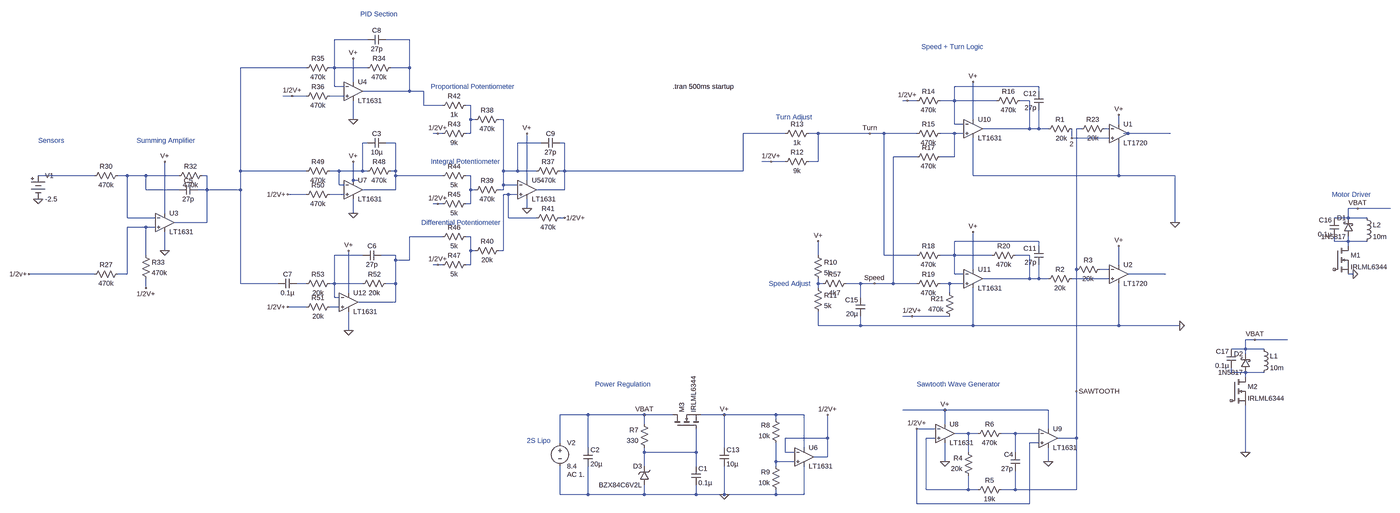
[diagram p0: schematic LTspiceIV_Simulation_AnalogLineFollower edited.asc, whole sheet]
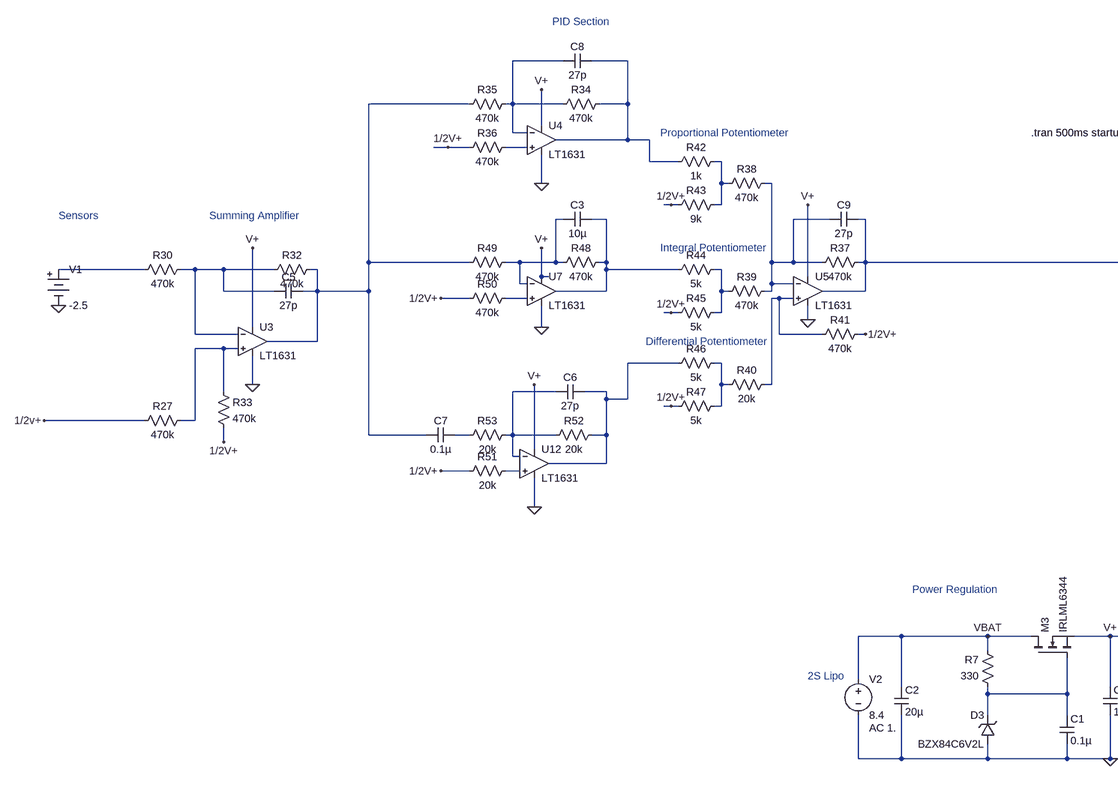
[diagram p1: schematic LTspiceIV_Simulation_AnalogLineFollower edited.asc, part, row 1 of 1, column 1 of 2]
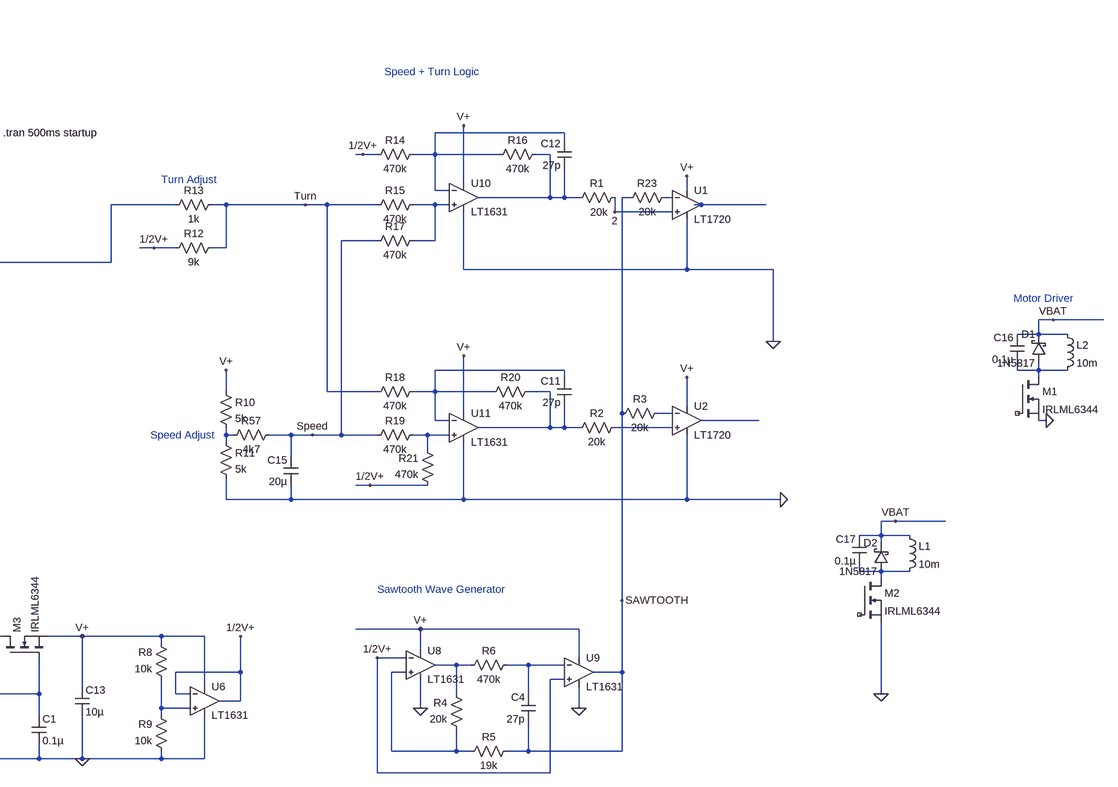
[diagram p2: schematic LTspiceIV_Simulation_AnalogLineFollower edited.asc, part, row 1 of 1, column 2 of 2]
LTspiceIV_Simulation_AnalogLineFollower edited.asc, the LTspice schematic file:
Version 4
SHEET 1 5945676 13421556
WIRE -1120 -1456 -1232 -1456
WIRE -976 -1456 -1056 -1456
WIRE -1328 -1360 -1552 -1360
WIRE -1232 -1360 -1232 -1456
WIRE -1232 -1360 -1248 -1360
WIRE -1120 -1360 -1232 -1360
WIRE -976 -1360 -976 -1456
WIRE -976 -1360 -1040 -1360
WIRE -1168 -1312 -1168 -1392
WIRE -1232 -1296 -1232 -1360
WIRE -1200 -1296 -1232 -1296
WIRE 1168 -1296 880 -1296
WIRE -976 -1280 -976 -1360
WIRE -976 -1280 -1136 -1280
WIRE -928 -1280 -976 -1280
WIRE 1168 -1280 1168 -1296
WIRE -1376 -1264 -1408 -1264
WIRE -1328 -1264 -1376 -1264
WIRE -1200 -1264 -1248 -1264
WIRE 720 -1248 704 -1248
WIRE 752 -1248 720 -1248
WIRE 880 -1248 880 -1296
WIRE 880 -1248 832 -1248
WIRE 1024 -1248 880 -1248
WIRE 1136 -1248 1104 -1248
WIRE -928 -1232 -928 -1280
WIRE -864 -1232 -928 -1232
WIRE -768 -1232 -784 -1232
WIRE -1168 -1184 -1168 -1248
WIRE -768 -1184 -768 -1232
WIRE -752 -1184 -768 -1184
WIRE -656 -1184 -672 -1184
WIRE 944 -1184 944 -1312
WIRE 880 -1168 880 -1248
WIRE 912 -1168 880 -1168
WIRE 1440 -1168 1440 -1200
WIRE 1136 -1152 1136 -1248
WIRE 1136 -1152 976 -1152
WIRE 1168 -1152 1168 -1216
WIRE 1168 -1152 1136 -1152
WIRE 1200 -1152 1168 -1152
WIRE 1312 -1152 1296 -1152
WIRE 1408 -1152 1392 -1152
WIRE -880 -1136 -896 -1136
WIRE -864 -1136 -880 -1136
WIRE -768 -1136 -768 -1184
WIRE -768 -1136 -784 -1136
WIRE 304 -1136 160 -1136
WIRE 416 -1136 384 -1136
WIRE 592 -1136 416 -1136
WIRE 640 -1136 592 -1136
WIRE 752 -1136 640 -1136
WIRE 880 -1136 832 -1136
WIRE 912 -1136 880 -1136
WIRE 1472 -1136 1456 -1136
WIRE 1616 -1136 1472 -1136
WIRE 1280 -1120 1280 -1152
WIRE 1408 -1120 1280 -1120
WIRE -1120 -1104 -1136 -1104
WIRE -1024 -1104 -1056 -1104
WIRE -528 -1104 -608 -1104
WIRE -448 -1104 -464 -1104
WIRE 752 -1056 672 -1056
WIRE 880 -1056 880 -1136
WIRE 880 -1056 832 -1056
WIRE 256 -1040 224 -1040
WIRE 304 -1040 256 -1040
WIRE 416 -1040 416 -1136
WIRE 416 -1040 384 -1040
WIRE -1552 -1008 -1552 -1360
WIRE -1328 -1008 -1552 -1008
WIRE -1216 -1008 -1248 -1008
WIRE -1136 -1008 -1136 -1104
WIRE -1136 -1008 -1216 -1008
WIRE -1120 -1008 -1136 -1008
WIRE -1024 -1008 -1024 -1104
WIRE -1024 -1008 -1040 -1008
WIRE -656 -1008 -656 -1184
WIRE -608 -1008 -608 -1104
WIRE -608 -1008 -656 -1008
WIRE -544 -1008 -608 -1008
WIRE -448 -1008 -448 -1104
WIRE -448 -1008 -464 -1008
WIRE 160 -1008 160 -1136
WIRE 160 -1008 -448 -1008
WIRE -2512 -992 -2800 -992
WIRE -2400 -992 -2432 -992
WIRE -2336 -992 -2400 -992
WIRE -2224 -992 -2336 -992
WIRE -2128 -992 -2144 -992
WIRE -1024 -992 -1024 -1008
WIRE -864 -992 -1024 -992
WIRE -768 -992 -784 -992
WIRE 944 -992 944 -1120
WIRE 1440 -992 1440 -1104
WIRE 1440 -992 944 -992
WIRE 1632 -992 1440 -992
WIRE -1168 -976 -1168 -1040
WIRE -1152 -976 -1168 -976
WIRE -576 -976 -576 -1136
WIRE -1216 -960 -1216 -1008
WIRE -1200 -960 -1216 -960
WIRE -656 -960 -656 -1008
WIRE -608 -960 -656 -960
WIRE -2336 -944 -2336 -992
WIRE -2224 -944 -2336 -944
WIRE -2128 -944 -2128 -992
WIRE -2128 -944 -2160 -944
WIRE -1552 -944 -1552 -1008
WIRE -1552 -944 -2128 -944
WIRE -1024 -944 -1024 -992
WIRE -1024 -944 -1136 -944
WIRE -768 -944 -768 -992
WIRE -752 -944 -768 -944
WIRE -656 -944 -656 -960
WIRE -656 -944 -672 -944
WIRE -448 -944 -448 -1008
WIRE -448 -944 -544 -944
WIRE -1328 -928 -1392 -928
WIRE -1200 -928 -1248 -928
WIRE -640 -928 -656 -928
WIRE -608 -928 -640 -928
WIRE -880 -896 -896 -896
WIRE -864 -896 -880 -896
WIRE -768 -896 -768 -944
WIRE -768 -896 -784 -896
WIRE -576 -880 -576 -912
WIRE 4816 -880 4784 -880
WIRE 4928 -880 4816 -880
WIRE -2272 -864 -2272 -1040
WIRE -1168 -864 -1168 -912
WIRE -2400 -848 -2400 -992
WIRE -2304 -848 -2400 -848
WIRE -640 -848 -640 -928
WIRE -544 -848 -640 -848
WIRE -448 -848 -464 -848
WIRE 4784 -848 4784 -880
WIRE 4784 -848 4736 -848
WIRE 4848 -848 4784 -848
WIRE -2128 -832 -2128 -944
WIRE -2128 -832 -2240 -832
WIRE 1632 -832 1632 -992
WIRE -2336 -816 -2400 -816
WIRE -2304 -816 -2336 -816
WIRE -864 -784 -976 -784
WIRE -768 -784 -784 -784
WIRE 1168 -768 880 -768
WIRE 4736 -768 4736 -784
WIRE 4784 -768 4784 -784
WIRE 4784 -768 4736 -768
WIRE 4848 -768 4784 -768
WIRE 1168 -752 1168 -768
WIRE 4784 -752 4784 -768
WIRE -2272 -736 -2272 -800
WIRE -768 -736 -768 -784
WIRE -752 -736 -768 -736
WIRE -656 -736 -656 -928
WIRE -656 -736 -672 -736
WIRE -2336 -720 -2336 -816
WIRE -1136 -720 -1232 -720
WIRE -1024 -720 -1072 -720
WIRE 416 -720 416 -768
WIRE 640 -720 640 -1136
WIRE 752 -720 640 -720
WIRE 880 -720 880 -768
WIRE 880 -720 832 -720
WIRE 1008 -720 880 -720
WIRE 1136 -720 1088 -720
WIRE -1024 -704 -1024 -720
WIRE -976 -704 -976 -784
WIRE -976 -704 -1024 -704
WIRE -880 -688 -896 -688
WIRE -864 -688 -880 -688
WIRE -768 -688 -768 -736
WIRE -768 -688 -784 -688
WIRE 1440 -688 1440 -752
WIRE 944 -672 944 -800
WIRE 1296 -672 1296 -1152
WIRE 1408 -672 1376 -672
WIRE -2512 -656 -2832 -656
WIRE -2400 -656 -2400 -816
WIRE -2400 -656 -2432 -656
WIRE 880 -656 880 -720
WIRE 912 -656 880 -656
WIRE 1600 -656 1472 -656
WIRE 4800 -656 4784 -656
WIRE 1136 -640 1136 -720
WIRE 1136 -640 976 -640
WIRE 1168 -640 1168 -688
WIRE 1168 -640 1136 -640
WIRE 1200 -640 1168 -640
WIRE 1408 -640 1280 -640
WIRE -1552 -624 -1552 -944
WIRE -1424 -624 -1552 -624
WIRE -1328 -624 -1360 -624
WIRE -1232 -624 -1232 -720
WIRE -1232 -624 -1248 -624
WIRE -1136 -624 -1232 -624
WIRE -1024 -624 -1024 -704
WIRE -1024 -624 -1056 -624
WIRE 416 -624 416 -640
WIRE 432 -624 416 -624
WIRE 560 -624 512 -624
WIRE 608 -624 560 -624
WIRE 672 -624 672 -1056
WIRE 672 -624 608 -624
WIRE 752 -624 672 -624
WIRE 864 -624 832 -624
WIRE 912 -624 864 -624
WIRE -2336 -608 -2336 -640
WIRE 416 -608 416 -624
WIRE -1184 -592 -1184 -736
WIRE 864 -592 864 -624
WIRE -1232 -576 -1232 -624
WIRE -1216 -576 -1232 -576
WIRE 560 -576 560 -624
WIRE -1024 -560 -1024 -624
WIRE -1024 -560 -1152 -560
WIRE -1328 -544 -1392 -544
WIRE -1216 -544 -1248 -544
WIRE 736 -512 704 -512
WIRE 864 -512 736 -512
WIRE 416 -480 416 -528
WIRE 560 -480 560 -512
WIRE 560 -480 416 -480
WIRE 944 -480 944 -608
WIRE 944 -480 560 -480
WIRE 1440 -480 1440 -624
WIRE 1440 -480 944 -480
WIRE 1648 -480 1440 -480
WIRE -1184 -464 -1184 -528
WIRE 4192 -432 4160 -432
WIRE 4304 -432 4192 -432
WIRE 4160 -400 4160 -432
WIRE 4160 -400 4112 -400
WIRE 4224 -400 4160 -400
WIRE 4160 -384 4160 -400
WIRE 4112 -320 4112 -336
WIRE 4160 -320 4112 -320
WIRE 4224 -320 4160 -320
WIRE 4160 -304 4160 -320
WIRE 1296 -256 1296 -672
WIRE 848 -192 704 -192
WIRE 1200 -192 848 -192
WIRE -368 -176 -464 -176
WIRE -176 -176 -368 -176
WIRE -80 -176 -176 -176
WIRE 96 -176 16 -176
WIRE 272 -176 96 -176
WIRE 368 -176 272 -176
WIRE 272 -160 272 -176
WIRE -176 -144 -176 -176
WIRE 848 -144 848 -192
WIRE 816 -128 752 -128
WIRE 1200 -128 1200 -192
WIRE 928 -112 880 -112
WIRE 960 -112 928 -112
WIRE 1088 -112 1040 -112
WIRE 1168 -112 1088 -112
WIRE 448 -96 448 -176
WIRE 448 -96 304 -96
WIRE 816 -96 784 -96
WIRE 1296 -96 1296 -256
WIRE 1296 -96 1232 -96
WIRE -464 -80 -464 -176
WIRE 1168 -80 1136 -80
WIRE -368 -64 -368 -176
WIRE 96 -64 96 -176
WIRE 368 -64 368 -176
WIRE -176 -48 -176 -64
WIRE 0 -48 0 -128
WIRE 0 -48 -176 -48
WIRE 304 -48 304 -96
WIRE 336 -48 304 -48
WIRE 928 -48 928 -112
WIRE 1088 -48 1088 -112
WIRE 4160 -48 4160 -208
WIRE 448 -32 448 -96
WIRE 448 -32 400 -32
WIRE 272 -16 272 -80
WIRE 336 -16 272 -16
WIRE 848 -16 848 -80
WIRE 1200 -16 1200 -64
WIRE -176 0 -176 -48
WIRE 0 0 0 -48
WIRE 272 0 272 -16
WIRE 784 80 784 -96
WIRE 928 80 928 32
WIRE 928 80 784 80
WIRE 960 80 928 80
WIRE 1088 80 1088 16
WIRE 1088 80 1040 80
WIRE 1296 80 1296 -96
WIRE 1296 80 1088 80
WIRE -464 96 -464 0
WIRE -368 96 -368 0
WIRE -368 96 -464 96
WIRE -176 96 -176 64
WIRE -176 96 -368 96
WIRE 0 96 0 64
WIRE 0 96 -176 96
WIRE 96 96 96 0
WIRE 96 96 0 96
WIRE 272 96 272 80
WIRE 272 96 96 96
WIRE 368 96 368 0
WIRE 368 96 272 96
WIRE 752 128 752 -128
WIRE 1136 128 1136 -80
WIRE 1136 128 752 128
FLAG 1296 -256 SAWTOOTH
FLAG -1184 -464 0
FLAG -1168 -1184 0
FLAG -1168 -864 0
FLAG -576 -880 0
FLAG 96 -176 V+
FLAG -1184 -736 V+
FLAG -1168 -1040 V+
FLAG -1168 -1392 V+
FLAG -576 -1136 V+
FLAG 944 -1312 V+
FLAG 1440 -1200 V+
FLAG 944 -800 V+
FLAG 1440 -752 V+
FLAG 1200 -16 0
FLAG 848 -16 0
FLAG 96 96 0
FLAG -176 -176 VBAT
FLAG 4192 -432 VBAT
FLAG 4816 -880 VBAT
FLAG -2272 -736 0
FLAG -2272 -1040 V+
FLAG 416 -768 V+
FLAG 448 -176 1/2V+
FLAG 736 -512 1/2V+
FLAG 720 -1248 1/2V+
FLAG -448 -848 1/2V+
FLAG -880 -1136 1/2V+
FLAG -880 -896 1/2V+
FLAG -880 -688 1/2V+
FLAG -1392 -544 1/2V+
FLAG -1392 -928 1/2V+
FLAG -1376 -1264 1/2V+
FLAG -2336 -608 1/2V+
FLAG 608 -624 Speed
FLAG 848 -192 V+
FLAG 1632 -832 0
FLAG 4160 -48 0
FLAG 256 -1040 1/2V+
FLAG 592 -1136 Turn
FLAG 752 -128 1/2V+
FLAG -2832 -656 1/2v+
FLAG -2800 -912 0
FLAG 4800 -656 0
FLAG 1648 -480 0
FLAG 1280 -1120 2
SYMBOL Opamps\\LT1631 368 -96 R0
SYMATTR InstName U6
SYMBOL Opamps\\LT1631 848 -176 R0
SYMATTR InstName U8
SYMBOL Opamps\\LT1631 1200 -160 R0
SYMATTR InstName U9
SYMBOL Opamps\\LT1631 944 -1216 R0
SYMATTR InstName U10
SYMBOL Opamps\\LT1631 944 -704 R0
SYMATTR InstName U11
SYMBOL res 288 -64 R180
WINDOW 0 36 76 Left 2
WINDOW 3 36 40 Left 2
SYMATTR InstName R8
SYMATTR Value 10k
SYMBOL res 288 96 R180
WINDOW 0 36 76 Left 2
WINDOW 3 36 40 Left 2
SYMATTR InstName R9
SYMATTR Value 10k
SYMBOL res 400 -736 R0
SYMATTR InstName R10
SYMATTR Value 5k
SYMBOL res 400 -624 R0
SYMATTR InstName R11
SYMATTR Value 5k
SYMBOL res 400 -1056 R90
WINDOW 0 0 56 VBottom 2
WINDOW 3 32 56 VTop 2
SYMATTR InstName R12
SYMATTR Value 9k
SYMATTR SpiceLine tol=1 pwr=0.1
SYMBOL res 400 -1152 R90
WINDOW 0 0 56 VBottom 2
WINDOW 3 32 56 VTop 2
SYMATTR InstName R13
SYMATTR Value 1k
SYMBOL res 848 -1264 R90
WINDOW 0 0 56 VBottom 2
WINDOW 3 32 56 VTop 2
SYMATTR InstName R14
SYMATTR Value 470k
SYMBOL res 848 -1152 R90
WINDOW 0 0 56 VBottom 2
WINDOW 3 32 56 VTop 2
SYMATTR InstName R15
SYMATTR Value 470k
SYMBOL res 1120 -1264 R90
WINDOW 0 0 56 VBottom 2
WINDOW 3 32 56 VTop 2
SYMATTR InstName R16
SYMATTR Value 470k
SYMBOL res 736 -1040 R270
WINDOW 0 32 56 VTop 2
WINDOW 3 0 56 VBottom 2
SYMATTR InstName R17
SYMATTR Value 470k
SYMBOL res 848 -736 R90
WINDOW 0 0 56 VBottom 2
WINDOW 3 32 56 VTop 2
SYMATTR InstName R18
SYMATTR Value 470k
SYMBOL res 848 -640 R90
WINDOW 0 0 56 VBottom 2
WINDOW 3 32 56 VTop 2
SYMATTR InstName R19
SYMATTR Value 470k
SYMBOL res 1104 -736 R90
WINDOW 0 0 56 VBottom 2
WINDOW 3 32 56 VTop 2
SYMATTR InstName R20
SYMATTR Value 470k
SYMBOL res 880 -496 R180
WINDOW 0 36 76 Left 2
WINDOW 3 36 40 Left 2
SYMATTR InstName R21
SYMATTR Value 470k
SYMBOL res 1296 -1168 R90
WINDOW 0 0 56 VBottom 2
WINDOW 3 33 51 VTop 2
SYMATTR InstName R1
SYMATTR Value 20k
SYMBOL res 1296 -656 R90
WINDOW 0 0 56 VBottom 2
WINDOW 3 32 56 VTop 2
SYMATTR InstName R2
SYMATTR Value 20k
SYMBOL res 944 48 R180
WINDOW 0 36 76 Left 2
WINDOW 3 36 40 Left 2
SYMATTR InstName R4
SYMATTR Value 20k
SYMBOL res 1056 64 R90
WINDOW 0 0 56 VBottom 2
WINDOW 3 32 56 VTop 2
SYMATTR InstName R5
SYMATTR Value 19k
SYMBOL cap 1104 16 R180
WINDOW 0 24 56 Left 2
WINDOW 3 24 8 Left 2
SYMATTR InstName C4
SYMATTR Value 27p
SYMBOL res 1056 -128 R90
WINDOW 0 0 56 VBottom 2
WINDOW 3 32 56 VTop 2
SYMATTR InstName R6
SYMATTR Value 470k
SYMBOL res 1392 -688 R90
WINDOW 0 0 56 VBottom 2
WINDOW 3 32 56 VTop 2
SYMATTR InstName R3
SYMATTR Value 20k
SYMBOL res 1408 -1168 R90
WINDOW 0 0 56 VBottom 2
WINDOW 3 32 56 VTop 2
SYMATTR InstName R23
SYMATTR Value 20k
SYMBOL cap 1184 -688 R180
WINDOW 0 24 56 Left 2
WINDOW 3 24 8 Left 2
SYMATTR InstName C11
SYMATTR Value 27p
SYMBOL cap 1184 -1216 R180
WINDOW 0 24 56 Left 2
WINDOW 3 24 8 Left 2
SYMATTR InstName C12
SYMATTR Value 27p
SYMBOL nmos 4736 -752 R0
SYMATTR InstName M1
SYMATTR Value IRLML6344
SYMBOL nmos 4112 -304 R0
SYMATTR InstName M2
SYMATTR Value IRLML6344
SYMBOL ind 4208 -416 R0
SYMATTR InstName L1
SYMATTR Value 10m
SYMATTR SpiceLine Rser=3.75
SYMBOL ind 4832 -864 R0
SYMATTR InstName L2
SYMATTR Value 10m
SYMATTR SpiceLine Rser=3.75
SYMBOL schottky 4176 -320 R180
WINDOW 0 24 64 Left 2
WINDOW 3 24 0 Left 2
SYMATTR InstName D2
SYMATTR Value 1N5817
SYMATTR Description Diode
SYMATTR Type diode
SYMBOL res -2528 -640 R270
WINDOW 0 32 56 VTop 2
WINDOW 3 0 56 VBottom 2
SYMATTR InstName R27
SYMATTR Value 470k
SYMBOL res -2528 -976 R270
WINDOW 0 32 56 VTop 2
WINDOW 3 0 56 VBottom 2
SYMATTR InstName R30
SYMATTR Value 470k
SYMBOL Opamps\\LT1631 -2272 -896 R0
SYMATTR InstName U3
SYMBOL res -2240 -976 R270
WINDOW 0 32 56 VTop 2
WINDOW 3 0 56 VBottom 2
SYMATTR InstName R32
SYMATTR Value 470k
SYMBOL res -2352 -736 R0
SYMATTR InstName R33
SYMATTR Value 470k
SYMBOL cap -2160 -960 R90
WINDOW 0 0 32 VBottom 2
WINDOW 3 32 32 VTop 2
SYMATTR InstName C5
SYMATTR Value 27p
SYMBOL Comparators\\LT1720 1440 -1200 R0
SYMATTR InstName U1
SYMBOL Comparators\\LT1720 1440 -720 R0
SYMATTR InstName U2
SYMBOL Opamps\\LT1631 -1168 -1344 R0
SYMATTR InstName U4
SYMBOL res -1136 -1344 R270
WINDOW 0 32 56 VTop 2
WINDOW 3 0 56 VBottom 2
SYMATTR InstName R34
SYMATTR Value 470k
SYMBOL res -1344 -1344 R270
WINDOW 0 32 56 VTop 2
WINDOW 3 0 56 VBottom 2
SYMATTR InstName R35
SYMATTR Value 470k
SYMBOL res -1344 -1248 R270
WINDOW 0 32 56 VTop 2
WINDOW 3 0 56 VBottom 2
SYMATTR InstName R36
SYMATTR Value 470k
SYMBOL Opamps\\LT1631 -576 -1008 R0
SYMATTR InstName U5
SYMBOL res -560 -992 R270
WINDOW 0 32 56 VTop 2
WINDOW 3 0 56 VBottom 2
SYMATTR InstName R37
SYMATTR Value 470k
SYMBOL res -768 -1168 R270
WINDOW 0 32 56 VTop 2
WINDOW 3 0 56 VBottom 2
SYMATTR InstName R38
SYMATTR Value 470k
SYMBOL res -768 -928 R270
WINDOW 0 32 56 VTop 2
WINDOW 3 0 56 VBottom 2
SYMATTR InstName R39
SYMATTR Value 470k
SYMBOL res -768 -720 R270
WINDOW 0 32 56 VTop 2
WINDOW 3 0 56 VBottom 2
SYMATTR InstName R40
SYMATTR Value 20k
SYMBOL res -560 -832 R270
WINDOW 0 32 56 VTop 2
WINDOW 3 0 56 VBottom 2
SYMATTR InstName R41
SYMATTR Value 470k
SYMBOL res -880 -1216 R270
WINDOW 0 32 56 VTop 2
WINDOW 3 0 56 VBottom 2
SYMATTR InstName R42
SYMATTR Value 1k
SYMBOL res -880 -1120 R270
WINDOW 0 32 56 VTop 2
WINDOW 3 0 56 VBottom 2
SYMATTR InstName R43
SYMATTR Value 9k
SYMBOL res -880 -976 R270
WINDOW 0 32 56 VTop 2
WINDOW 3 0 56 VBottom 2
SYMATTR InstName R44
SYMATTR Value 5k
SYMBOL res -880 -880 R270
WINDOW 0 32 56 VTop 2
WINDOW 3 0 56 VBottom 2
SYMATTR InstName R45
SYMATTR Value 5k
SYMBOL res -880 -768 R270
WINDOW 0 32 56 VTop 2
WINDOW 3 0 56 VBottom 2
SYMATTR InstName R46
SYMATTR Value 5k
SYMBOL res -880 -672 R270
WINDOW 0 32 56 VTop 2
WINDOW 3 0 56 VBottom 2
SYMATTR InstName R47
SYMATTR Value 5k
SYMBOL Opamps\\LT1631 -1168 -1008 R0
SYMATTR InstName U7
SYMBOL res -1136 -992 R270
WINDOW 0 32 56 VTop 2
WINDOW 3 0 56 VBottom 2
SYMATTR InstName R48
SYMATTR Value 470k
SYMBOL res -1344 -992 R270
WINDOW 0 32 56 VTop 2
WINDOW 3 0 56 VBottom 2
SYMATTR InstName R49
SYMATTR Value 470k
SYMBOL res -1344 -912 R270
WINDOW 0 32 56 VTop 2
WINDOW 3 0 56 VBottom 2
SYMATTR InstName R50
SYMATTR Value 470k
SYMBOL cap -1120 -1088 R270
WINDOW 0 32 32 VTop 2
WINDOW 3 0 32 VBottom 2
SYMATTR InstName C3
SYMATTR Value 10µ
SYMBOL Opamps\\LT1631 -1184 -624 R0
SYMATTR InstName U12
SYMBOL res -1344 -528 R270
WINDOW 0 32 56 VTop 2
WINDOW 3 0 56 VBottom 2
SYMATTR InstName R51
SYMATTR Value 20k
SYMBOL res -1152 -608 R270
WINDOW 0 32 56 VTop 2
WINDOW 3 0 56 VBottom 2
SYMATTR InstName R52
SYMATTR Value 20k
SYMBOL res -1344 -608 R270
WINDOW 0 32 56 VTop 2
WINDOW 3 0 56 VBottom 2
SYMATTR InstName R53
SYMATTR Value 20k
SYMBOL cap -1136 -704 R270
WINDOW 0 32 32 VTop 2
WINDOW 3 0 32 VBottom 2
SYMATTR InstName C6
SYMATTR Value 27p
SYMBOL cap -1424 -608 R270
WINDOW 0 32 32 VTop 2
WINDOW 3 0 32 VBottom 2
SYMATTR InstName C7
SYMATTR Value 0.1µ
SYMBOL cap -1056 -1472 R90
WINDOW 0 0 32 VBottom 2
WINDOW 3 32 32 VTop 2
SYMATTR InstName C8
SYMATTR Value 27p
SYMBOL cap -464 -1120 R90
WINDOW 0 0 32 VBottom 2
WINDOW 3 32 32 VTop 2
SYMATTR InstName C9
SYMATTR Value 27p
SYMBOL nmos -80 -128 R270
SYMATTR InstName M3
SYMATTR Value IRLML6344
SYMBOL res -160 -48 R180
WINDOW 0 36 76 Left 2
WINDOW 3 36 40 Left 2
SYMATTR InstName R7
SYMATTR Value 330
SYMBOL zener -160 64 R180
WINDOW 0 24 64 Left 2
WINDOW 3 24 0 Left 2
SYMATTR InstName D3
SYMATTR Value BZX84C6V2L
SYMATTR Description Diode
SYMATTR Type diode
SYMBOL cap -16 0 R0
SYMATTR InstName C1
SYMATTR Value 0.1µ
SYMBOL voltage -464 -96 R0
WINDOW 123 24 124 Left 2
WINDOW 39 0 0 Left 2
SYMATTR Value2 AC 1.
SYMATTR InstName V2
SYMATTR Value 8.4
SYMBOL cap -384 -64 R0
SYMATTR InstName C2
SYMATTR Value 20µ
SYMBOL cap 80 -64 R0
SYMATTR InstName C13
SYMATTR Value 10µ
SYMBOL res 528 -640 R90
WINDOW 0 0 56 VBottom 2
WINDOW 3 32 56 VTop 2
SYMATTR InstName R57
SYMATTR Value 4k7
SYMBOL cap 576 -512 R180
WINDOW 0 24 56 Left 2
WINDOW 3 24 8 Left 2
SYMATTR InstName C15
SYMATTR Value 20µ
SYMBOL schottky 4800 -784 R180
WINDOW 0 24 64 Left 2
WINDOW 3 24 0 Left 2
SYMATTR InstName D1
SYMATTR Value 1N5817
SYMATTR Description Diode
SYMATTR Type diode
SYMBOL cap 4752 -784 R180
WINDOW 0 24 56 Left 2
WINDOW 3 24 8 Left 2
SYMATTR InstName C16
SYMATTR Value 0.1µ
SYMBOL cap 4128 -336 R180
WINDOW 0 24 56 Left 2
WINDOW 3 24 8 Left 2
SYMATTR InstName C17
SYMATTR Value 0.1µ
SYMBOL Misc\\battery -2800 -1008 R0
WINDOW 123 0 0 Left 0
WINDOW 39 0 0 Left 0
SYMATTR InstName V1
SYMATTR Value -2.5
TEXT -80 -1296 Left 2 !.tran 500ms startup
TEXT -1144 -1544 Left 2 ;PID Section
TEXT -2800 -1112 Left 2 ;Sensors
TEXT -2368 -1112 Left 2 ;Summing Amplifier
TEXT -904 -1296 Left 2 ;Proportional Potentiometer
TEXT -904 -1040 Left 2 ;Integral Potentiometer
TEXT -936 -832 Left 2 ;Differential Potentiometer
TEXT -344 -280 Left 2 ;Power Regulation
TEXT 752 -280 Left 2 ;Sawtooth Wave Generator
TEXT 768 -1432 Left 2 ;Speed + Turn Logic
TEXT 4728 -928 Left 2 ;Motor Driver
TEXT 248 -624 Left 2 ;Speed Adjust
TEXT 272 -1192 Left 2 ;Turn Adjust
TEXT -576 -88 Left 2 ;2S Lipo

The netlist it stands for:
* LTspiceIV_Simulation_AnalogLineFollower edited.asc
XU6 N039 1/2V+ V+ 0 1/2V+ LT1630  ; LT1631, pins In+ In- V+ V- OUT
XU8 N037 1/2V+ V+ 0 N035 LT1630  ; LT1631, pins In+ In- V+ V- OUT
XU9 1/2V+ N036 V+ 0 SAWTOOTH LT1630  ; LT1631, pins In+ In- V+ V- OUT
XU10 N011 N004 V+ 0 N006 LT1630  ; LT1631, pins In+ In- V+ V- OUT
XU11 N032 N023 V+ 0 N026 LT1630  ; LT1631, pins In+ In- V+ V- OUT
R8 N039 V+ 10k
R9 0 N039 10k
R10 V+ N031 5k
R11 N031 0 5k
R12 Turn 1/2V+ 9k tol=1 pwr=0.1
R13 Turn N010 1k
R14 N004 1/2V+ 470k
R15 N011 Turn 470k
R16 N006 N004 470k
R17 Speed N011 470k
R18 N023 Turn 470k
R19 N032 Speed 470k
R20 N026 N023 470k
R21 1/2V+ N032 470k
R1 2 N006 20k
R2 N029 N026 20k
R4 N037 N035 20k
R5 SAWTOOTH N037 19k
C4 SAWTOOTH N036 27p
R6 N036 N035 470k
R3 N027 SAWTOOTH 20k
R23 N009 SAWTOOTH 20k
C11 N026 N023 27p
C12 N006 N004 27p
M1 N024 NC_01 0 0 IRLML6344
M2 N034 NC_02 0 0 IRLML6344
L1 VBAT N034 10m Rser=3.75
L2 VBAT N024 10m Rser=3.75
D2 N034 VBAT 1N5817
R27 1/2V+ N020 470k
R30 N015 N016 470k
XU3 N020 N016 V+ 0 N003 LT1630  ; LT1631, pins In+ In- V+ V- OUT
R32 N016 N003 470k
R33 N020 1/2V+ 470k
C5 N003 N016 27p
XU1 2 N009 V+ 0 N012 LT1720  ; pins In+ In- V+ V- OUT
XU2 N029 N027 V+ 0 N028 LT1720  ; pins In+ In- V+ V- OUT
XU4 N005 N001 V+ 0 N002 LT1630  ; LT1631, pins In+ In- V+ V- OUT
R34 N001 N002 470k
R35 N003 N001 470k
R36 1/2V+ N005 470k
XU5 N019 N008 V+ 0 N010 LT1630  ; LT1631, pins In+ In- V+ V- OUT
R37 N008 N010 470k
R38 N007 N008 470k
R39 N017 N008 470k
R40 N022 N019 20k
R41 N019 1/2V+ 470k
R42 N002 N007 1k
R43 1/2V+ N007 9k
R44 N014 N017 5k
R45 1/2V+ N017 5k
R46 N021 N022 5k
R47 1/2V+ N022 5k
XU7 N018 N013 V+ 0 N014 LT1630  ; LT1631, pins In+ In- V+ V- OUT
R48 N013 N014 470k
R49 N003 N013 470k
R50 1/2V+ N018 470k
C3 N013 N014 10µ
XU12 N033 N025 V+ 0 N021 LT1630  ; LT1631, pins In+ In- V+ V- OUT
R51 1/2V+ N033 20k
R52 N025 N021 20k
R53 N030 N025 20k
C6 N025 N021 27p
C7 N003 N030 0.1µ
C8 N002 N001 27p
C9 N010 N008 27p
M3 VBAT N038 V+ V+ IRLML6344
R7 N038 VBAT 330
D3 0 N038 BZX84C6V2L
C1 N038 0 0.1µ
V2 VBAT 0 8.4 AC 1.
C2 VBAT 0 20µ
C13 V+ 0 10µ
R57 Speed N031 4k7
C15 0 Speed 20µ
D1 N024 VBAT 1N5817
C16 N024 VBAT 0.1µ
C17 N034 VBAT 0.1µ
V1 N015 0 -2.5
.model D D
.lib standard.dio
.model NMOS NMOS
.model PMOS PMOS
.lib standard.mos
.tran 500ms startup
* PID Section
* Sensors
* Summing Amplifier
* Proportional Potentiometer
* Integral Potentiometer
* Differential Potentiometer
* Power Regulation
* Sawtooth Wave Generator
* Speed + Turn Logic
* Motor Driver
* Speed Adjust
* Turn Adjust
* 2S Lipo
.lib LTC.lib
.lib LT1720.sub
.backanno
.end